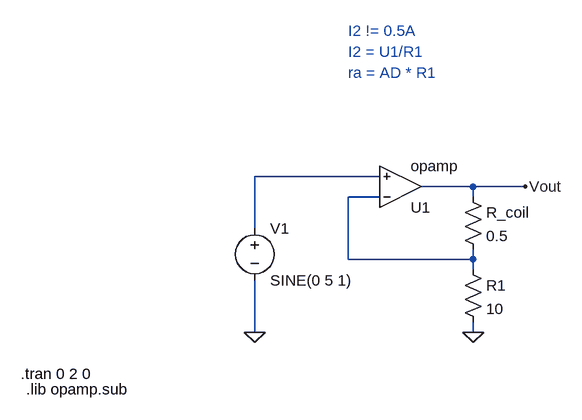
[diagram p0: schematic 230531-ideal_channel.asc]
230531-ideal_channel.asc, the LTspice schematic file:
Version 4
SHEET 1 880 712
WIRE 192 128 0 128
WIRE 336 144 256 144
WIRE 416 144 336 144
WIRE 192 160 144 160
WIRE 336 160 336 144
WIRE 0 208 0 128
WIRE 144 256 144 160
WIRE 336 256 336 240
WIRE 336 256 144 256
WIRE 336 272 336 256
WIRE 0 368 0 288
WIRE 336 368 336 352
FLAG 0 368 0
FLAG 336 368 0
FLAG 416 144 Vout
SYMBOL voltage 0 192 R0
WINDOW 123 0 0 Left 0
WINDOW 39 0 0 Left 0
SYMATTR InstName V1
SYMATTR Value SINE(0 5 1)
SYMBOL res 320 144 R0
SYMATTR InstName R_coil
SYMATTR Value 0.5
SYMBOL res 320 256 R0
SYMATTR InstName R1
SYMATTR Value 10
SYMBOL OpAmps\\opamp 224 208 M180
SYMATTR InstName U1
TEXT 144 -64 Left 2 ;I2 = U1/R1
TEXT 144 -32 Left 2 ;ra = AD * R1
TEXT -360 432 Left 2 !.tran 0 2 0
TEXT -352 456 Left 2 !.lib opamp.sub
TEXT 144 -96 Left 2 ;I2 != 0.5A

The netlist it stands for:
* 230531-ideal_channel.asc
V1 N001 0 SINE(0 5 1)
R_coil Vout N002 0.5
R1 N002 0 10
XU1 N002 N001 Vout opamp Aol=100K GBW=10Meg  ; pins invin noninvin out
* I2 = U1/R1
* ra = AD * R1
.tran 0 2 0
.lib opamp.sub
* I2 != 0.5A
.backanno
.end